# EAGLE schematic freezer_alarm (EAGLE 9.3.2)
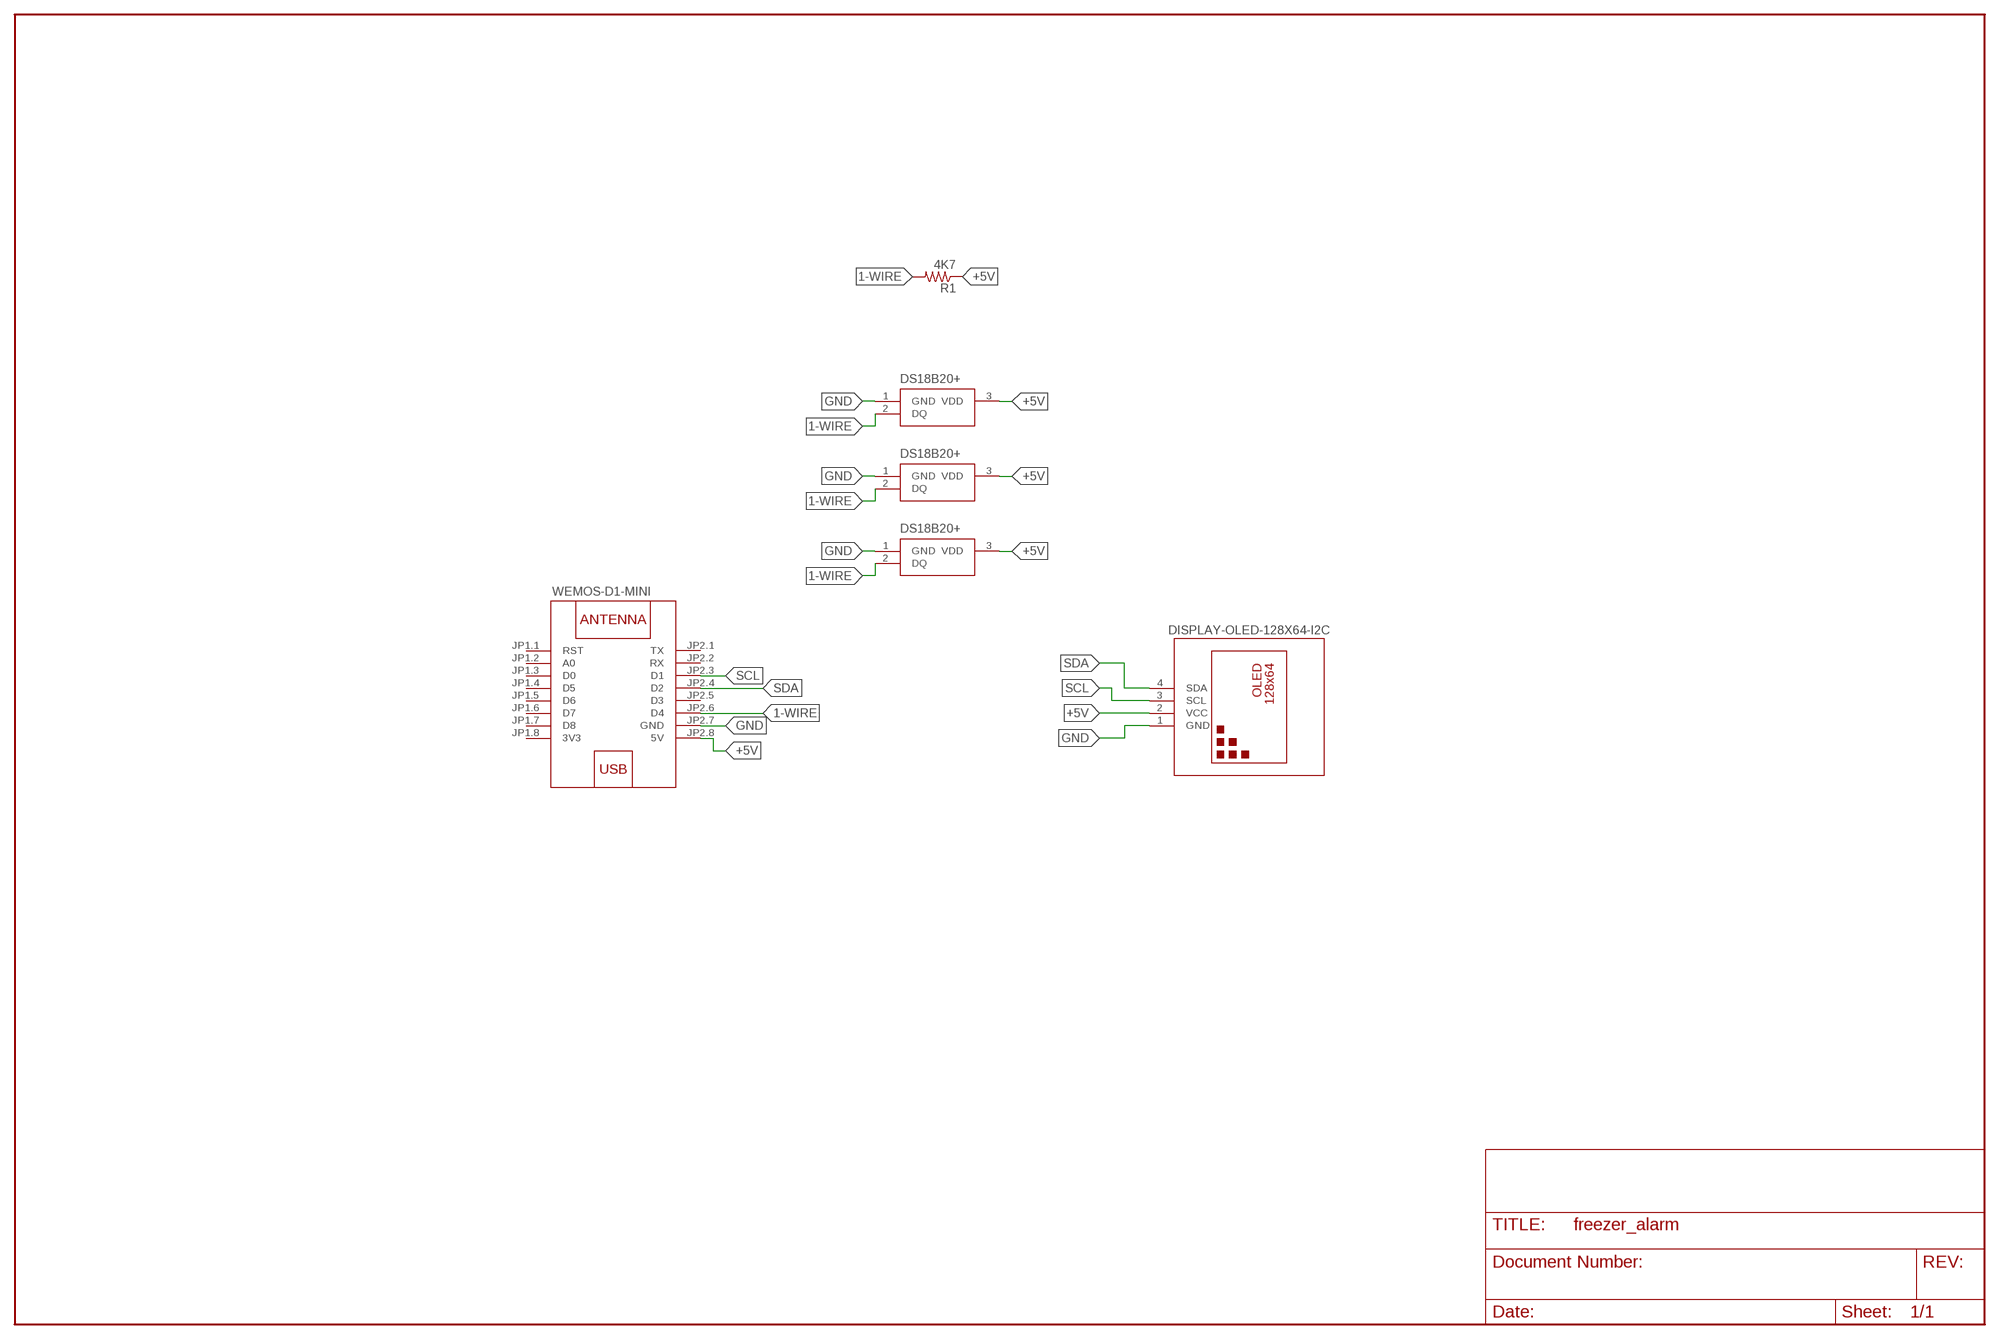
[diagram p0: schematic, sheet 1]

## Parts
DISP  DISPLAY-OLED-128X64-I2C  [DISPLAY-OLED-128X64-I2C]
IC1  DS18B20+  [TO-92]
IC2  DS18B20+  [TO-92]
IC3  DS18B20+  [TO-92]
R1  4K7  R-US_0207/10  [0207/10]
W1  WEMOS-D1-MINI  [WEMOS-D1-MINI]

## Nets
1-WIRE: IC1.2(DQ) IC2.2(DQ) IC3.2(DQ) W1.JP2.6(D4)
+5V: DISP.2(VCC) IC1.3(VDD) IC2.3(VDD) IC3.3(VDD) W1.JP2.8(5V)
GND: DISP.1(GND) IC1.1(GND) IC2.1(GND) IC3.1(GND) W1.JP2.7(GND)
SCL: DISP.3(SCL) W1.JP2.3(D1)
SDA: DISP.4(SDA) W1.JP2.4(D2)
Unconnected: R1.1 R1.2 W1.JP1.1(RST) W1.JP1.2(A0) W1.JP1.3(D0) W1.JP1.4(D5) W1.JP1.5(D6) W1.JP1.6(D7) W1.JP1.7(D8) W1.JP2.1(TX) W1.JP2.2(RX) W1.JP2.5(D3)

## Power pins joined to a net without a drawn wire
3V3: W1.JP1.8(3V3)

## Library data of the parts
DISP = diy-modules:DISPLAY-OLED-128X64-I2C: 128x64 Dot Matrix OLED Module based on SSD1306 chip Variant with I2C interface More details available here: http://www.instructables.com/id/Monochrome-096-i2c-OLED-display-with-arduino-SSD13/ SSD1306 datasheet: https://cdn-shop.adafruit.com/datasheets/SSD1306.pdf Click here to find device on ebay.com <http://www.ebay.com/sch/oled+display+128x64+iic> Note: There are two variants: I2C and SPI. Search for the proper version.
IC1-IC3 = SamacSys_Parts:DS18B20+: DS18B20 prog thermometer 1-Wire, TO92 Source: Datasheet <https://componentsearchengine.com/Datasheets/1/DS18B20 .pdf>; DESCRIPTION: DS18B20 prog thermometer 1-Wire, TO92; HEIGHT: mm; MANUFACTURER_NAME: Maxim Integrated; MANUFACTURER_PART_NUMBER: DS18B20+; MOUSER_PART_NUMBER: 700-DS18B20+; MOUSER_PRICE-STOCK: https://www.mouser.com/Search/Refine.aspx?Keyword=700-DS18B20%2B
R1 = adafruit:R-US_: RESISTOR, American symbol
W1 = diy-modules:WEMOS-D1-MINI: WEMOS D1 mini: Mini Wi-Fi Board based on ESP-8266 device More details can be found here: https://www.wemos.cc/product/d1-mini.html Click here to find device on ebay.com <http://www.ebay.com/sch/wemos+d1+mini+nodemcu>